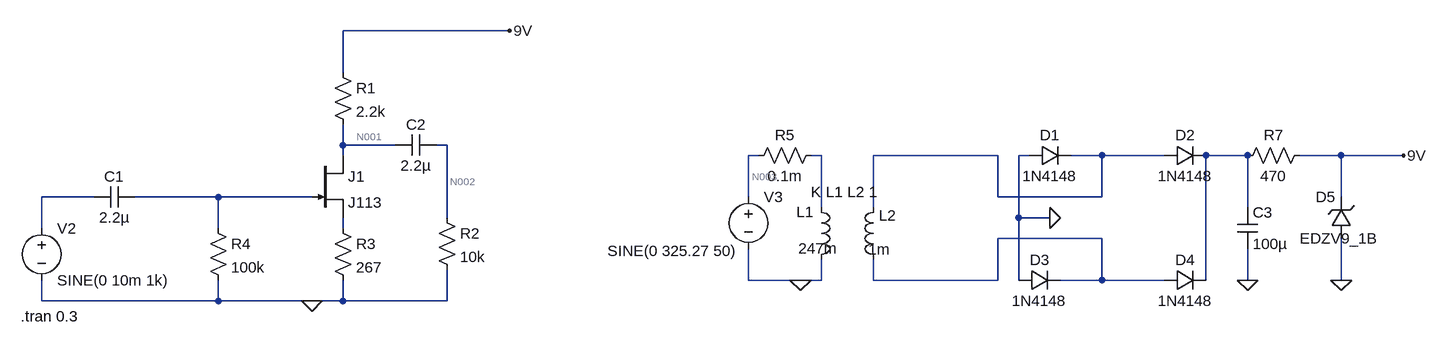
[diagram p0: schematic Both_in_one.asc]
Both_in_one.asc, the LTspice schematic file:
Version 4.1
SHEET 1 1592 680
WIRE 160 -32 -96 -32
WIRE -96 32 -96 -32
WIRE -96 144 -96 112
WIRE -16 144 -96 144
WIRE 64 144 48 144
WIRE -96 160 -96 144
WIRE 544 160 528 160
WIRE 640 160 624 160
WIRE 912 160 720 160
WIRE 960 160 944 160
WIRE 1072 160 1024 160
WIRE 1168 160 1072 160
WIRE 1296 160 1232 160
WIRE 1440 160 1376 160
WIRE 1536 160 1440 160
WIRE -480 224 -560 224
WIRE -288 224 -416 224
WIRE -144 224 -288 224
WIRE 528 224 528 160
WIRE 912 224 912 160
WIRE 1072 224 1072 160
WIRE 1072 224 912 224
WIRE 1440 224 1440 160
WIRE 640 240 640 160
WIRE 720 240 720 160
WIRE 1296 240 1296 160
WIRE 64 256 64 144
WIRE 944 256 944 160
WIRE 992 256 944 256
WIRE -560 272 -560 224
WIRE -288 272 -288 224
WIRE -96 272 -96 256
WIRE 1072 288 912 288
WIRE 528 352 528 304
WIRE 608 352 528 352
WIRE 640 352 640 320
WIRE 640 352 608 352
WIRE 720 352 720 320
WIRE 912 352 912 288
WIRE 912 352 720 352
WIRE 944 352 944 256
WIRE 1072 352 1072 288
WIRE 1072 352 1008 352
WIRE 1168 352 1072 352
WIRE 1232 352 1232 160
WIRE 1296 352 1296 304
WIRE 1440 352 1440 288
WIRE -560 384 -560 352
WIRE -288 384 -288 352
WIRE -288 384 -560 384
WIRE -144 384 -288 384
WIRE -96 384 -96 352
WIRE -96 384 -144 384
WIRE 64 384 64 336
WIRE 64 384 -96 384
FLAG -144 384 0
FLAG 608 352 0
FLAG 992 256 0
FLAG 1296 352 0
FLAG 1440 352 0
FLAG 1536 160 9V
FLAG 160 -32 9V
SYMBOL njf -144 160 R0
SYMATTR InstName J1
SYMATTR Value J113
SYMBOL res -112 16 R0
SYMATTR InstName R1
SYMATTR Value 2.2k
SYMBOL voltage -560 256 R0
WINDOW 123 0 0 Left 0
WINDOW 39 0 0 Left 0
SYMATTR InstName V2
SYMATTR Value SINE(0 10m 1k)
SYMBOL cap -416 208 R90
WINDOW 0 0 32 VBottom 2
WINDOW 3 32 32 VTop 2
SYMATTR InstName C1
SYMATTR Value 2.2µ
SYMBOL cap 48 128 R90
WINDOW 0 0 32 VBottom 2
WINDOW 3 32 32 VTop 2
SYMATTR InstName C2
SYMATTR Value 2.2µ
SYMBOL res 48 240 R0
SYMATTR InstName R2
SYMATTR Value 10k
SYMBOL res -112 256 R0
SYMATTR InstName R3
SYMATTR Value 267
SYMBOL res -304 256 R0
SYMATTR InstName R4
SYMATTR Value 100k
SYMBOL ind 624 224 R0
WINDOW 0 -22 23 Left 2
WINDOW 3 -19 79 Left 2
SYMATTR InstName L1
SYMATTR Value 247m
SYMBOL ind 736 336 R180
WINDOW 0 -20 84 Left 2
WINDOW 3 -10 31 Left 2
SYMATTR InstName L2
SYMATTR Value 1m
SYMBOL voltage 528 208 R0
WINDOW 3 -217 99 Left 2
WINDOW 123 0 0 Left 0
WINDOW 39 0 0 Left 0
SYMATTR Value SINE(0 325.27 50)
SYMATTR InstName V3
SYMBOL res 640 144 R90
WINDOW 0 0 56 VBottom 2
WINDOW 3 32 56 VTop 2
SYMATTR InstName R5
SYMATTR Value 0.1m
SYMBOL diode 960 176 R270
WINDOW 0 32 32 VTop 2
WINDOW 3 0 32 VBottom 2
SYMATTR InstName D1
SYMATTR Value 1N4148
SYMBOL diode 1168 176 R270
WINDOW 0 32 32 VTop 2
WINDOW 3 0 32 VBottom 2
SYMATTR InstName D2
SYMATTR Value 1N4148
SYMBOL diode 944 368 R270
WINDOW 0 32 32 VTop 2
WINDOW 3 0 32 VBottom 2
SYMATTR InstName D3
SYMATTR Value 1N4148
SYMBOL diode 1168 368 R270
WINDOW 0 32 32 VTop 2
WINDOW 3 0 32 VBottom 2
SYMATTR InstName D4
SYMATTR Value 1N4148
SYMBOL cap 1280 240 R0
SYMATTR InstName C3
SYMATTR Value 100µ
SYMBOL res 1392 144 R90
WINDOW 0 0 56 VBottom 2
WINDOW 3 32 56 VTop 2
SYMATTR InstName R7
SYMATTR Value 470
SYMBOL zener 1456 288 R180
WINDOW 0 24 64 Left 2
WINDOW 3 -40 0 Left 2
SYMATTR InstName D5
SYMATTR Value EDZV9_1B
TEXT 624 216 Left 2 !K L1 L2 1
TEXT -592 408 Left 2 !.tran 0.3

The netlist it stands for:
* Both_in_one.asc
J1 N001 N008 N009 J113
R1 9V N001 2.2k
V2 N007 0 SINE(0 10m 1k)
C1 N008 N007 2.2µ
C2 N002 N001 2.2µ
R2 N002 0 10k
R3 N009 0 267
R4 N008 0 100k
L1 N004 0 247m
L2 N010 N005 1m
V3 N003 0 SINE(0 325.27 50)
R5 N004 N003 0.1m
D1 0 N005 1N4148
D2 N005 N006 1N4148
D3 0 N010 1N4148
D4 N010 N006 1N4148
C3 N006 0 100µ
R7 9V N006 470
D5 0 9V EDZV9_1B
.model D D
.lib standard.dio
.model NJF NJF
.model PJF PJF
.lib standard.jft
K L1 L2 1
.tran 0.3
.backanno
.end

* Results of the author's LTspice run, read from the files saved beside the schematic
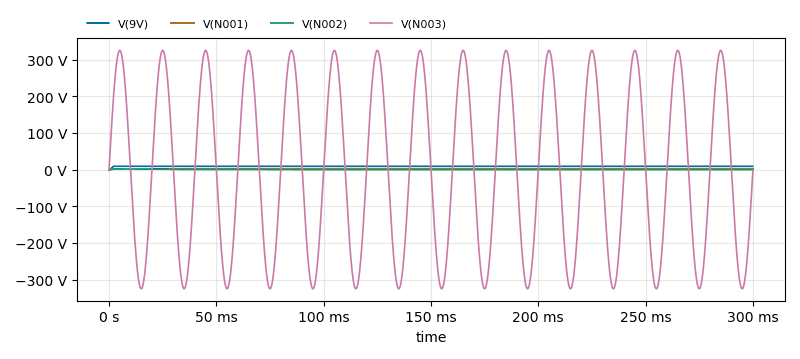
[diagram p1: Transient Analysis of Both_in_one.asc, plotted from the saved traces]
* Transient Analysis, 1 run:
*   V(9V): min 0 V, max 9.052 V, average 9.013 V, rms 9.027 V, last 9.05 V
*   V(N001): min 0 V, max 2.453 V, average 2.353 V, rms 2.36 V, last 2.404 V
*   V(N002): min -49.79 mV, max 1.932 V, average 176.3 mV, rms 414 mV, last -442.7 µV
*   V(N003): min -325.3 V, max 325.3 V, average -340.2 µV, rms 230 V, last 0 V